# EAGLE schematic Display (EAGLE 6.4)
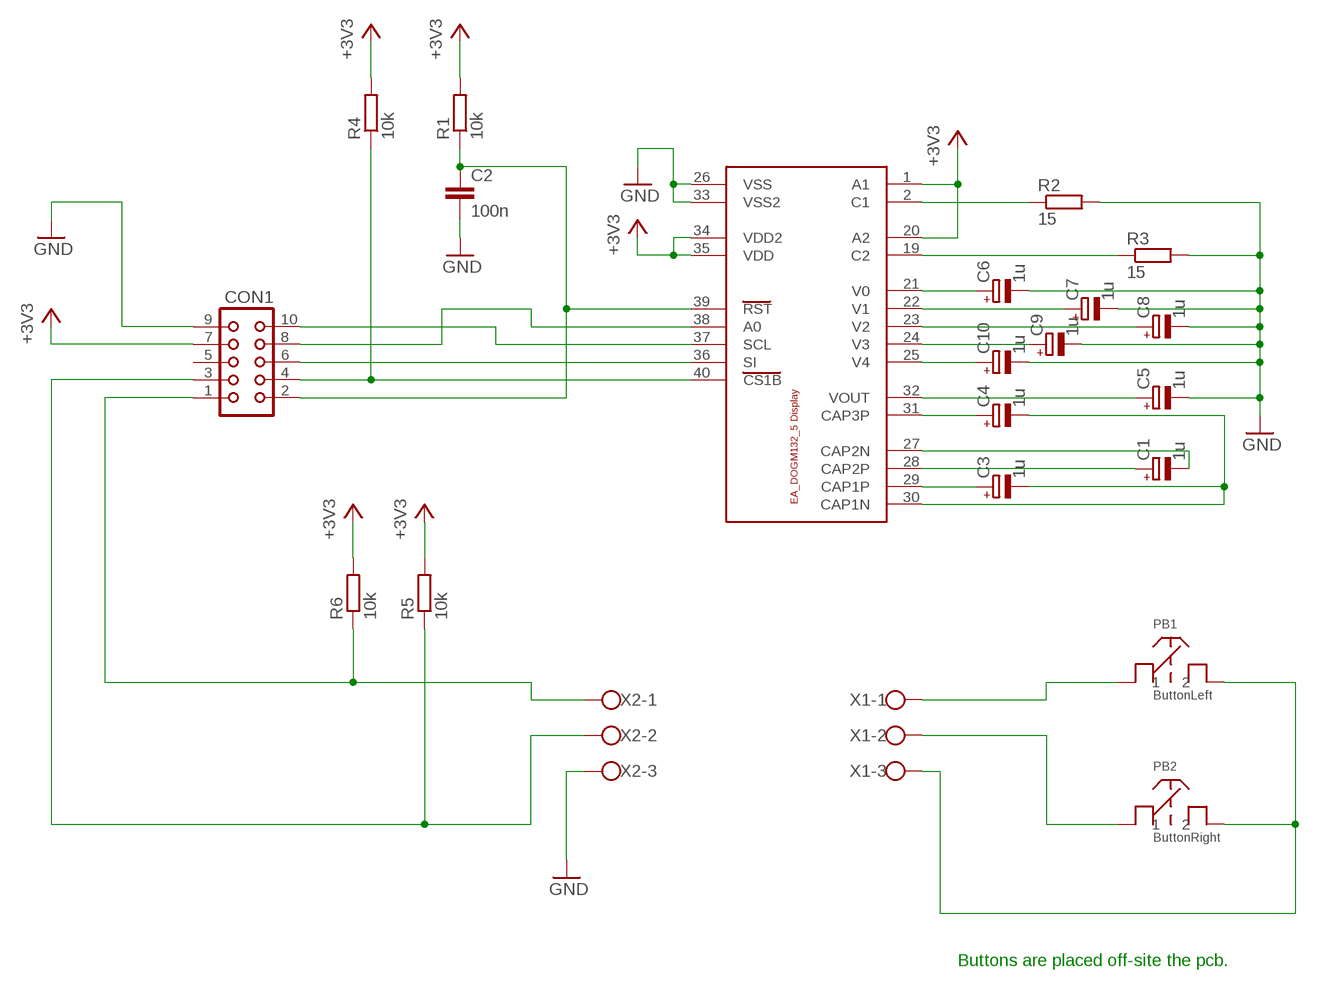
[diagram p0: schematic, sheet 1]

## Parts
C1  1u  CPOL-EUA  [PANASONIC_A]
C2  100n  C-EU025-040X050  [C025-040X050]
C3  1u  CPOL-EUA  [PANASONIC_A]
C4  1u  CPOL-EUA  [PANASONIC_A]
C5  1u  CPOL-EUA  [PANASONIC_A]
C6  1u  CPOL-EUA  [PANASONIC_A]
C7  1u  CPOL-EUA  [PANASONIC_A]
C8  1u  CPOL-EUA  [PANASONIC_A]
C9  1u  CPOL-EUA  [PANASONIC_A]
C10  1u  CPOL-EUA  [PANASONIC_A]
CON1  CON10L  [CON10L]
PB1  ButtonLeft  PBNO-M  [PBNO-M]
PB2  ButtonRight  PBNO-M  [PBNO-M]
R1  10k  R-EU_0204/5  [0204/5]
R2  15  R-EU_0204/5  [0204/5]
R3  15  R-EU_0204/5  [0204/5]
R4  10k  R-EU_0204/5  [0204/5]
R5  10k  R-EU_0204/5  [0204/5]
R6  10k  R-EU_0204/5  [0204/5]
U$1  EA_DOG-M_DISPLAY  [E_DOG-M_DISPLAY]
X1  W237-103  [W237-103]
X2  W237-103  [W237-103]

## Nets
+3V3: CON1.7 R1.2 R4.2 R5.2 R6.2 U$1.1(A1) U$1.20(A2) U$1.34(VDD2) U$1.35(VDD)
GND: C2.2 C5.- C6.- C7.- C8.- C9.- C10.- CON1.9 R2.2 R3.2 U$1.26(VSS) U$1.33(VSS2) X2.3
N$2: CON1.3 R5.1 X2.2
N$3: CON1.4 R4.1 U$1.40(CS1B)
N$4: CON1.6 U$1.36(SI)
N$5: CON1.10 U$1.37(SCL)
N$6: CON1.8 U$1.38(A0)
N$7: C2.1 CON1.2 R1.1 U$1.39(RST)
N$8: CON1.1 R6.1 X2.1
N$9: R2.1 U$1.2(C1)
N$10: R3.1 U$1.19(C2)
N$11: C5.+ U$1.32(VOUT)
N$12: C6.+ U$1.21(V0)
N$13: C7.+ U$1.22(V1)
N$14: C8.+ U$1.23(V2)
N$15: C9.+ U$1.24(V3)
N$16: C10.+ U$1.25(V4)
N$17: C1.- U$1.27(CAP2N)
N$18: C1.+ U$1.28(CAP2P)
N$19: C4.+ U$1.31(CAP3P)
N$20: C3.- C4.- U$1.30(CAP1N)
N$21: C3.+ U$1.29(CAP1P)
N$22: PB1.P$2 PB2.P$2 X1.3
N$24: PB2.P$1 X1.2
N$25: PB1.P$1 X1.1
Unconnected: CON1.5

## Notes on the sheet
- Buttons are placed off-site the pcb.

## Library data of the parts
C1 C3-C10 = rcl:CPOL-EU: POLARIZED CAPACITOR, European symbol
C2 = rcl:C-EU: CAPACITOR, European symbol
CON1 = con-harting:CON10L: CONNECTOR; OC_FARNELL: unknown; OC_NEWARK: unknown
PB1 PB2 = pushbuttons2:PBNO-M
R1-R6 = rcl:R-EU_: RESISTOR, European symbol
U$1 = display_ea_dogm132:EA_DOG-M_DISPLAY
X1 X2 = con-wago-500:W237-103: WAGO SCREW CLAMP; MPN: 237-103; OC_FARNELL: unknown; OC_NEWARK: 18M7116